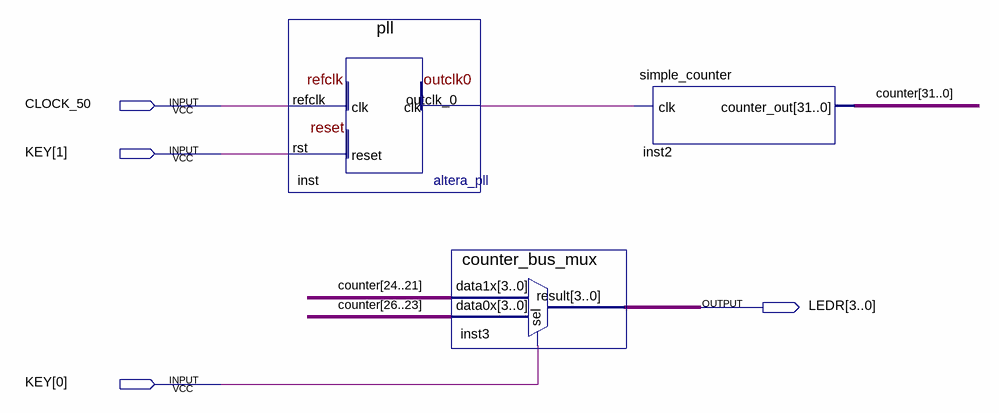
[diagram p0: schematic sheet]
// Quartus schematic my_first_fpga.bdf as structural Verilog: 3 symbols, 4 pins
module my_first_fpga (
  input  CLOCK_50,
  input  [1:0] KEY,
  output [3:0] LEDR
);

  wire inst_outclk_0;
  wire [31:0] counter;

  pll inst (.refclk(CLOCK_50), .rst(KEY[1]), .outclk_0(inst_outclk_0));
  counter_bus_mux inst3 (.data1x(counter[24:21]), .data0x(counter[26:23]), .sel(KEY[0]), .result(LEDR));
  simple_counter inst2 (.clk(inst_outclk_0), .counter_out(counter));
endmodule
